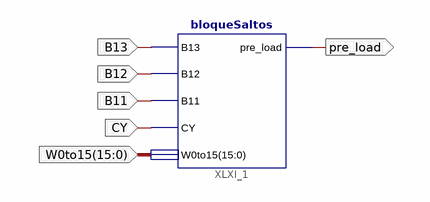
[diagram p0: schematic sheet 1]
// Xilinx ISE schematic test.sch (artix7) as structural Verilog: 1 symbols, 6 ports
module test (
  input  B13,
  input  B12,
  input  B11,
  input  CY,
  input  [15:0] W0to15,
  output pre_load
);

  bloqueSaltos XLXI_1 (.B13(B13), .B12(B12), .B11(B11), .CY(CY), .W0to15(W0to15), .pre_load(pre_load));
endmodule
